# Altium schematic sheet OLED.SchDoc
size A4
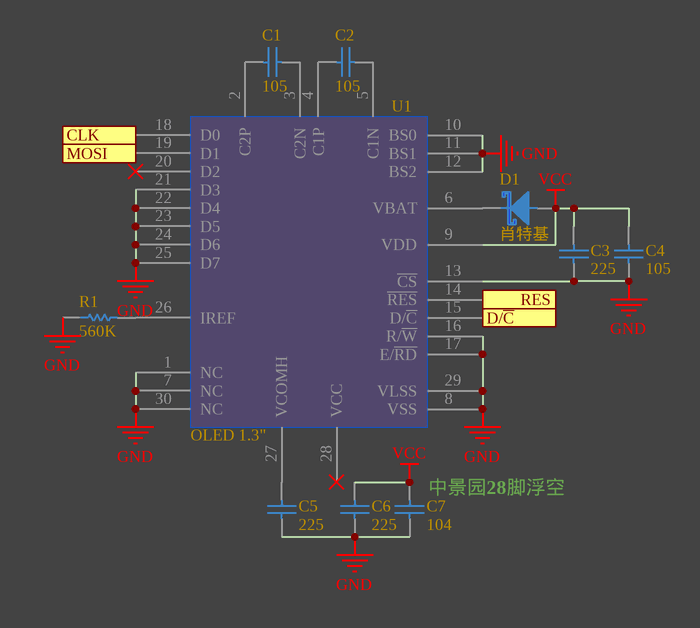
[diagram p0: OLED.SchDoc]

## Parts
C1  105  [C0603]
C2  105  [C0603]
C3  225  [C0603]
C4  105  [C0603]
C5  225  [C0603]
C6  225  [C0603]
C7  104  [C0402]
D1  肖特基  [SOD-123]
R1  560K  [R0402]
U1  OLED 1.3"  [OLED1.3"]

## Ports
CLK (in), D/~{C} (in), MOSI (in), RES (in)

## Nets
GND: C3.1 C4.1 C5.1 C6.1 C7.1 R1.1 U1.1(NC) U1.7(NC) U1.8(VSS) U1.10(BS0) U1.11(BS1) U1.12(BS2) U1.13(~{CS}) U1.16(R/~{W}) U1.17(E/~{RD}) U1.21(D3) U1.22(D4) U1.23(D5) U1.24(D6) U1.25(D7) U1.29(VLSS) U1.30(NC)
VCC: C3.2 C4.2 C6.2 C7.2 D1.1(A) U1.9(VDD)
CLK: U1.18(D0) ; port CLK
D/~{C}: U1.15(D/~{C}) ; port D/~{C}
MOSI: U1.19(D1) ; port MOSI
RES: U1.14(~{RES}) ; port RES
NetC1_1: C1.1 U1.2(C2P)
NetC1_2: C1.2 U1.3(C2N)
NetC2_1: C2.1 U1.4(C1P)
NetC2_2: C2.2 U1.5(C1N)
NetC5_2: C5.2 U1.27(VCOMH)
NetD1_2: D1.2(K) U1.6(VBAT)
NetR1_2: R1.2 U1.26(IREF)

Not connected (* = marked no-connect by the designer): U1 20(D2)* 28(VCC)*

## Notes on the sheet
- (near C7) 中景园28脚浮空

## Library data of the parts
C1-C7 = 电容: Capacitor; Value: 22pF; Published: 8-Jun-2000; LatestRevisionDate: 17-Jul-2002; LatestRevisionNote: Re-released for DXP Platform.; PackageReference: RAD-0.3; Publisher: Altium Limited; PackageDescription: Radial Cap, Thru-Hole; 2 Leads; 0.3 in Pin Spacing
D1 = 肖特基: Schottky Diode
R1 = 电阻: Resistor; Value: 150R; Published: 8-Jun-2000; LatestRevisionDate: 17-Jul-2002; LatestRevisionNote: Re-released for DXP Platform.; PackageReference: AXIAL-0.3; Publisher: Altium Limited; PackageDescription: Axial Device, Thru-Hole; 2 Leads; 0.3 in Pin Spacing
U1 = SSD1315: SSD1306